# Altium schematic sheet Ultrasonic_HC-SR04.SchDoc
size A4
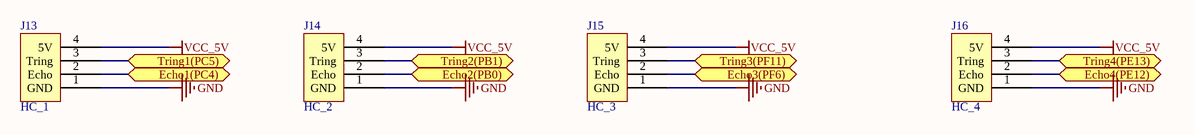
[diagram p0: Ultrasonic_HC-SR04.SchDoc]

## Parts
J13  HC_1  [XH2.54-WI-4P]
J14  HC_2  [XH2.54-WI-4P]
J15  HC_3  [XH2.54-WI-4P]
J16  HC_4  [XH2.54-WI-4P]

## Ports
Echo1(PC4) (bidir), Echo2(PB0) (bidir), Echo3(PF6) (bidir), Echo4(PE12) (bidir), Tring1(PC5) (bidir), Tring2(PB1) (bidir), Tring3(PF11) (bidir), Tring4(PE13) (bidir)

## Nets
GND: J13.1(GND) J14.1(GND) J15.1(GND) J16.1(GND)
VCC_5V: J13.4(5V) J14.4(5V) J15.4(5V) J16.4(5V)
Echo1(PC4): J13.2(Echo) ; port Echo1(PC4)
Echo2(PB0): J14.2(Echo) ; port Echo2(PB0)
Echo3(PF6): J15.2(Echo) ; port Echo3(PF6)
Echo4(PE12): J16.2(Echo) ; port Echo4(PE12)
Tring1(PC5): J13.3(Tring) ; port Tring1(PC5)
Tring2(PB1): J14.3(Tring) ; port Tring2(PB1)
Tring3(PF11): J15.3(Tring) ; port Tring3(PF11)
Tring4(PE13): J16.3(Tring) ; port Tring4(PE13)

## Library data of the parts
J13-J16 = Component_5